# Altium project prj_prj0.PrjPcb
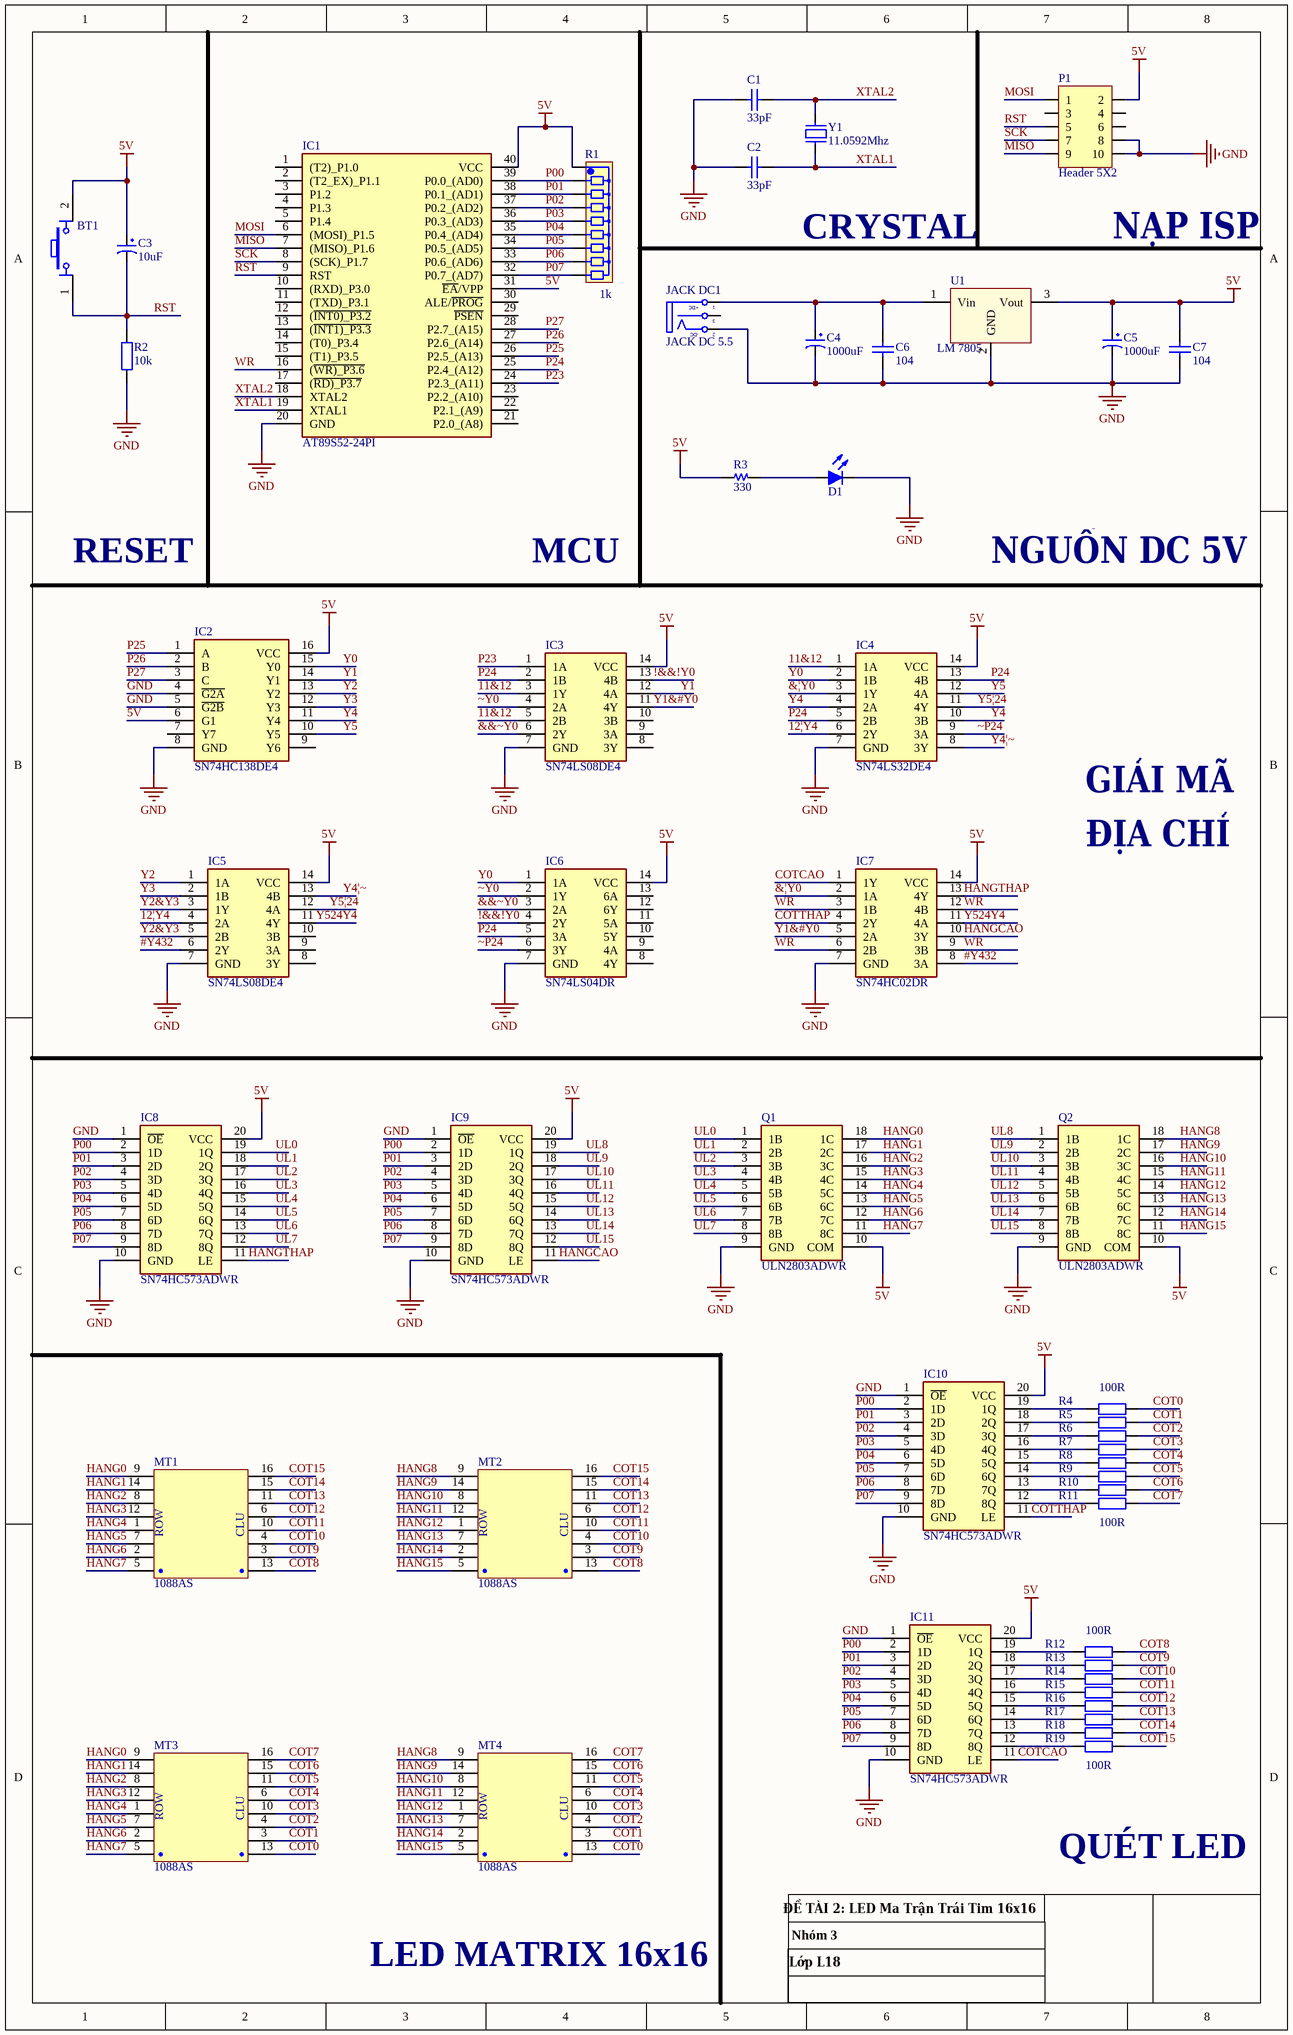
[diagram p0: sch_project0.SchDoc]
1 sheet, 49 parts. Net scope: global (net labels, ports and power ports of the same name join across sheets).
Board file: pcb_project0.PcbDoc

## Sheet sch_project0.SchDoc
size B portrait; SheetNumber: 1; SheetTotal: 1

### Parts
BT1  Nut Nhan 4 Chan Cam 6x6  [Nut Nhan 4 Chan Cam 6x6]  (value not drawn)
C1  33pF  [tu gom]
C2  33pF  [tu gom]
C3  10uF  [tu hoa 4mm]
C4  1000uF  [tu hoa 8mm]
C5  1000uF  [tu hoa 8mm]
C6  104  [tu gom]
C7  104  [tu gom]
D1  Led  [LED 5MM - RED]  (value not drawn)
IC1  AT89S52-24PI  [DIP1556W56P254L5232H483Q40N]
IC2  SN74HC138DE4  [SOIC127P600X175-16N]
IC3  SN74LS08DE4  [SOIC127P600X175-14N]
IC4  SN74LS32DE4  [SOIC127P600X175-14N]
IC5  SN74LS08DE4  [SOIC127P600X175-14N]
IC6  SN74LS04DR  [SOIC127P600X175-14N]
IC7  SN74HC02DR  [SOIC127P600X175-14N]
IC8  SN74HC573ADWR  [SOIC127P1030X265-20N]
IC9  SN74HC573ADWR  [SOIC127P1030X265-20N]
IC10  SN74HC573ADWR  [SOIC127P1030X265-20N]
IC11  SN74HC573ADWR  [SOIC127P1030X265-20N]
JACK_DC1  JACK DC 5.5  [JACK DC 5.5]
MT1  1088AS  [Matrix]
MT2  1088AS  [Matrix]
MT3  1088AS  [Matrix]
MT4  1088AS  [Matrix]
P1  Header 5X2  [HDR/Header/10/DL/BOX]
Q1  ULN2803ADWR  [SOIC127P1030X265-18N]
Q2  ULN2803ADWR  [SOIC127P1030X265-18N]
R1  1k  [tro bang a9]
R2  10k  [tro vach 1/4w]
R3  330  [R 1/4W/300]
R4  100R  [tro smd 0603]
R5  100R  [tro smd 0603]  (value not drawn)
R6  100R  [tro smd 0603]  (value not drawn)
R7  100R  [tro smd 0603]  (value not drawn)
R8  100R  [tro smd 0603]  (value not drawn)
R9  100R  [tro smd 0603]  (value not drawn)
R10  100R  [tro smd 0603]  (value not drawn)
R11  100R  [tro smd 0603]
R12  100R  [tro smd 0603]
R13  100R  [tro smd 0603]  (value not drawn)
R14  100R  [tro smd 0603]  (value not drawn)
R15  100R  [tro smd 0603]  (value not drawn)
R16  100R  [tro smd 0603]  (value not drawn)
R17  100R  [tro smd 0603]  (value not drawn)
R18  100R  [tro smd 0603]  (value not drawn)
R19  100R  [tro smd 0603]
U1  LM 7805  [TO-220]
Y1  11.0592Mhz  [Thach Anh 2 chan cam]

### Nets
5V: BT1.2 C3.1 C5.1 C7.1 IC1.31(~{EA}/VPP) IC1.40(VCC) IC2.6(G1) IC2.16(VCC) IC3.14(VCC) IC4.14(VCC) IC5.14(VCC) IC6.14(VCC) IC7.14(VCC) IC8.20(VCC) IC9.20(VCC) IC10.20(VCC) IC11.20(VCC) P1.2 Q1.10(COM) Q2.10(COM) R1.1 R3.1 U1.3(Vout)
GND: C1.2 C2.2 C4.2 C5.2 C6.2 C7.2 D1.2(K) IC1.20(GND) IC2.4(~{G2A}) IC2.5(~{G2B}) IC2.8(GND) IC3.7(GND) IC4.7(GND) IC5.7(GND) IC6.7(GND) IC7.7(GND) IC8.1(~{OE}) IC8.10(GND) IC9.1(~{OE}) IC9.10(GND) IC10.1(~{OE}) IC10.10(GND) IC11.1(~{OE}) IC11.10(GND) JACK_DC1.2(TN) P1.8 P1.10 Q1.9(GND) Q2.9(GND) R2.1 U1.2(GND)
11&12: IC3.3(1Y) IC3.5(2B) IC4.1(1A)
12|Y4: IC4.6(2Y) IC5.4(2A)
!&&!Y0: IC3.13(4B) IC6.4(2Y)
#Y432: IC5.6(2Y) IC7.8(3A)
&&~Y0: IC3.6(2Y) IC6.3(2A)
&|Y0: IC4.3(1Y) IC7.2(1A)
COT0: MT3.13(C1) MT4.13(C1) R4.2
COT1: MT3.3(C2) MT4.3(C2) R5.2
COT2: MT3.4(C3) MT4.4(C3) R6.2
COT3: MT3.10(C4) MT4.10(C4) R7.2
COT4: MT3.6(C5) MT4.6(C5) R8.2
COT5: MT3.11(C6) MT4.11(C6) R9.2
COT6: MT3.15(C7) MT4.15(C7) R10.2
COT7: MT3.16(C8) MT4.16(C8) R11.2
COT8: MT1.13(C1) MT2.13(C1) R12.2
COT9: MT1.3(C2) MT2.3(C2) R13.2
COT10: MT1.4(C3) MT2.4(C3) R14.2
COT11: MT1.10(C4) MT2.10(C4) R15.2
COT12: MT1.6(C5) MT2.6(C5) R16.2
COT13: MT1.11(C6) MT2.11(C6) R17.2
COT14: MT1.15(C7) MT2.15(C7) R18.2
COT15: MT1.16(C8) MT2.16(C8) R19.2
COTCAO: IC7.1(1Y) IC11.11(LE)
COTTHAP: IC7.4(2Y) IC10.11(LE)
HANG0: MT1.9(H8) MT3.9(H8) Q1.18(1C)
HANG1: MT1.14(H7) MT3.14(H7) Q1.17(2C)
HANG2: MT1.8(H6) MT3.8(H6) Q1.16(3C)
HANG3: MT1.12(H5) MT3.12(H5) Q1.15(4C)
HANG4: MT1.1(H4) MT3.1(H4) Q1.14(5C)
HANG5: MT1.7(H3) MT3.7(H3) Q1.13(6C)
HANG6: MT1.2(H2) MT3.2(H2) Q1.12(7C)
HANG7: MT1.5(H1) MT3.5(H1) Q1.11(8C)
HANG8: MT2.9(H8) MT4.9(H8) Q2.18(1C)
HANG9: MT2.14(H7) MT4.14(H7) Q2.17(2C)
HANG10: MT2.8(H6) MT4.8(H6) Q2.16(3C)
HANG11: MT2.12(H5) MT4.12(H5) Q2.15(4C)
HANG12: MT2.1(H4) MT4.1(H4) Q2.14(5C)
HANG13: MT2.7(H3) MT4.7(H3) Q2.13(6C)
HANG14: MT2.2(H2) MT4.2(H2) Q2.12(7C)
HANG15: MT2.5(H1) MT4.5(H1) Q2.11(8C)
HANGCAO: IC7.10(3Y) IC9.11(LE)
HANGTHAP: IC7.13(4Y) IC8.11(LE)
MISO: IC1.7((MISO)_P1.6) P1.9
MOSI: IC1.6((MOSI)_P1.5) P1.1
P00: IC1.39(P0.0_(AD0)) IC8.2(1D) IC9.2(1D) IC10.2(1D) IC11.2(1D) R1.2
P01: IC1.38(P0.1_(AD1)) IC8.3(2D) IC9.3(2D) IC10.3(2D) IC11.3(2D) R1.3
P02: IC1.37(P0.2_(AD2)) IC8.4(3D) IC9.4(3D) IC10.4(3D) IC11.4(3D) R1.4
P03: IC1.36(P0.3_(AD3)) IC8.5(4D) IC9.5(4D) IC10.5(4D) IC11.5(4D) R1.5
P04: IC1.35(P0.4_(AD4)) IC8.6(5D) IC9.6(5D) IC10.6(5D) IC11.6(5D) R1.6
P05: IC1.34(P0.5_(AD5)) IC8.7(6D) IC9.7(6D) IC10.7(6D) IC11.7(6D) R1.7
P06: IC1.33(P0.6_(AD6)) IC8.8(7D) IC9.8(7D) IC10.8(7D) IC11.8(7D) R1.8
P07: IC1.32(P0.7_(AD7)) IC8.9(8D) IC9.9(8D) IC10.9(8D) IC11.9(8D) R1.9
P23: IC1.24(P2.3_(A11)) IC3.1(1A)
P24: IC1.25(P2.4_(A12)) IC3.2(1B) IC4.5(2B) IC4.13(4B) IC6.5(3A)
P25: IC1.26(P2.5_(A13)) IC2.1(A)
P26: IC1.27(P2.6_(A14)) IC2.2(B)
P27: IC1.28(P2.7_(A15)) IC2.3(C)
RST: BT1.1 C3.2 IC1.9(RST) P1.5 R2.2
SCK: IC1.8((SCK)_P1.7) P1.7
UL0: IC8.19(1Q) Q1.1(1B)
UL1: IC8.18(2Q) Q1.2(2B)
UL2: IC8.17(3Q) Q1.3(3B)
UL3: IC8.16(4Q) Q1.4(4B)
UL4: IC8.15(5Q) Q1.5(5B)
UL5: IC8.14(6Q) Q1.6(6B)
UL6: IC8.13(7Q) Q1.7(7B)
UL7: IC8.12(8Q) Q1.8(8B)
UL8: IC9.19(1Q) Q2.1(1B)
UL9: IC9.18(2Q) Q2.2(2B)
UL10: IC9.17(3Q) Q2.3(3B)
UL11: IC9.16(4Q) Q2.4(4B)
UL12: IC9.15(5Q) Q2.5(5B)
UL13: IC9.14(6Q) Q2.6(6B)
UL14: IC9.13(7Q) Q2.7(7B)
UL15: IC9.12(8Q) Q2.8(8B)
WR: IC1.16((~{WR)_P3.6}) IC7.3(1B) IC7.6(2B) IC7.9(3B) IC7.12(4B)
XTAL1: C2.1 IC1.19(XTAL1) Y1.1
XTAL2: C1.1 IC1.18(XTAL2) Y1.2
Y0: IC2.15(Y0) IC4.2(1B) IC6.1(1A)
Y1: IC2.14(Y1) IC3.12(4A)
Y1&#Y0: IC3.11(4Y) IC7.5(2A)
Y2: IC2.13(Y2) IC5.1(1A)
Y2&Y3: IC5.3(1Y) IC5.5(2B)
Y3: IC2.12(Y3) IC5.2(1B)
Y4: IC2.11(Y4) IC4.4(2A) IC4.10(3B)
Y4|~: IC4.8(3Y) IC5.13(4B)
Y5: IC2.10(Y5) IC4.12(4A)
Y5|24: IC4.11(4Y) IC5.12(4A)
Y524Y4: IC5.11(4Y) IC7.11(4A)
~P24: IC4.9(3A) IC6.6(3Y)
~Y0: IC3.4(2A) IC6.2(1Y)
NetC4_1: C4.1 C6.1 JACK_DC1.1(T) U1.1(Vin)
NetD1_1: D1.1(A) R3.2
NetIC10_12: IC10.12(8Q) R11.1
NetIC10_13: IC10.13(7Q) R10.1
NetIC10_14: IC10.14(6Q) R9.1
NetIC10_15: IC10.15(5Q) R8.1
NetIC10_16: IC10.16(4Q) R7.1
NetIC10_17: IC10.17(3Q) R6.1
NetIC10_18: IC10.18(2Q) R5.1
NetIC10_19: IC10.19(1Q) R4.1
NetIC11_12: IC11.12(8Q) R19.1
NetIC11_13: IC11.13(7Q) R18.1
NetIC11_14: IC11.14(6Q) R17.1
NetIC11_15: IC11.15(5Q) R16.1
NetIC11_16: IC11.16(4Q) R15.1
NetIC11_17: IC11.17(3Q) R14.1
NetIC11_18: IC11.18(2Q) R13.1
NetIC11_19: IC11.19(1Q) R12.1

Not connected (* = marked no-connect by the designer): IC1 1((T2)_P1.0) 2((T2_EX)_P1.1) 3(P1.2) 4(P1.3) 5(P1.4) 10((RXD)_P3.0) 11((TXD)_P3.1) 12((~{INT0)_P3.2}) 13((~{INT1)_P3.3}) 14((T0)_P3.4) 15((T1)_P3.5) 17((~{RD)_P3.7}) 21(P2.0_(A8)) 22(P2.1_(A9)) 23(P2.2_(A10)) 29(~{PSEN}) 30(ALE/~{PROG}); IC2 7(Y7) 9(Y6); IC3 8(3Y) 9(3A) 10(3B); IC5 8(3Y) 9(3A) 10(3B); IC6 8(4Y) 9(4A) 10(5Y) 11(5A) 12(6Y) 13(6A); JACK_DC1 3(S); P1 3 4 6

### Notes on the sheet
- CRYSTAL
- NẠP ISP
- RESET
- MCU
- NGUỒN DC 5V
- GIẢI MÃ
- ĐỊA CHỈ
- ĐỀ TÀI 2: LED Ma Trận Trái Tim 16x16
- QUÉT LED
- LED MATRIX 16x16
- Nhóm 3
- Lớp L18
- (in symbol JACK DC 5.5) +DC; -DC
- (in symbol LED 8x8S) ROW; CLU

### Library data of the parts
BT1 = Nut Nhan 4 Chan Cam 6x6: Nut Nhan 4 Chan 6x6mm; Ten: Nút Nhấn 4 Chân 6x6x5MM DIP; Ma_Hang: MH004584
C1 C2 C6 C7 = Tu gom 104 50V: Cắm; So_Chan: 2; Ten_Linh_Kien: Tụ gốm 104 100nF 50V; Don_Vi: Con; Ma_Hang: MH004761; Chung_Loai: Cắm; Kieu_Chan: *
C3 = Tu Hoa 10uF 16V 4x7: Cắm; So_Chan: 2; Don_Vi: Con; Ten_Linh_Kien: Tụ Hóa 10uF 16V; Ma_Hang: MH006855; Chung_Loai: Cắm; Kieu_Chan: *
C4 C5 = Tu Hoa 1000uF 16V 8x20: Cắm; Don_Vi: Con; So_Chan: 2; Ten_Linh_Kien: Tụ Hóa 1000uF 16V 8x20MM; Ma_Hang: MH008300; Chung_Loai: Cắm; Kieu_Chan: *
D1 = Led: Typical LED
IC1 = AT89S52-24PI: Integrated Circuit; Manufacturer_Name: Microchip; Datasheet Link: http://www.microchip.com/mymicrochip/filehandler.aspx?ddocname=en590628; Height: 4.826mm; Manufacturer_Part_Number: AT89S52-24PI
IC2 = SN74HC138DE4: Integrated Circuit; Manufacturer_Name: Texas Instruments; Datasheet Link: https://www.ti.com/lit/ds/symlink/sn74hc138.pdf?HQS=TI-null-null-mousermode-df-pf-null-wwe&ts=1600076106087&ref_url=https%253A%252F%252Fwww.mouser.sg%252F; Height: 1.75mm; Manufacturer_Part_Number: SN74HC138DE4; Mouser Part Number: 595-SN74HC138DE4; Mouser Price/Stock: https://www.mouser.co.uk/ProductDetail/Texas-Instruments/SN74HC138DE4?qs=AgY10sKTvDISmT%2FT80QgQA%3D%3D; Arrow Part Number: SN74HC138DE4; Arrow Price/Stock: https://www.arrow.com/en/products/sn74hc138de4/texas-instruments
IC3 IC5 = SN74LS08DE4: Integrated Circuit; Manufacturer_Name: Texas Instruments; Datasheet Link: http://www.ti.com/general/docs/suppproductinfo.tsp?distId=26&gotoUrl=http%3A%2F%2Fwww.ti.com%2Flit%2Fgpn%2FSN74LS08; Height: 1.75mm; Manufacturer_Part_Number: SN74LS08DE4; Mouser Part Number: 595-SN74LS08DE4; Mouser Price/Stock: https://www.mouser.com/Search/Refine.aspx?Keyword=595-SN74LS08DE4; Arrow Part Number: SN74LS08DE4; Arrow Price/Stock: https://www.arrow.com/en/products/sn74ls08de4/texas-instruments
IC4 = SN74LS32DE4: Integrated Circuit; Manufacturer_Name: Texas Instruments; Datasheet Link: https://www.arrow.com/en/products/sn74ls32de4/texas-instruments; Height: 1.75mm; Manufacturer_Part_Number: SN74LS32DE4; Mouser Part Number: 595-SN74LS32DE4; Mouser Price/Stock: https://www.mouser.co.uk/ProductDetail/Texas-Instruments/SN74LS32DE4?qs=SL3LIuy2dWyjvHQzVXNE%252BQ%3D%3D; Arrow Part Number: SN74LS32DE4; Arrow Price/Stock: https://www.arrow.com/en/products/sn74ls32de4/texas-instruments
IC6 = SN74LS04DR: Integrated Circuit; Manufacturer_Name: Texas Instruments; Datasheet Link: http://www.ti.com/lit/ds/symlink/sn74ls04.pdf; Height: 1.75mm; Manufacturer_Part_Number: SN74LS04DR; Mouser Part Number: 595-SN74LS04DR; Mouser Price/Stock: https://www.mouser.co.uk/ProductDetail/Texas-Instruments/SN74LS04DR?qs=SL3LIuy2dWzOhepjTMFpMg%3D%3D; Arrow Part Number: SN74LS04DR; Arrow Price/Stock: https://www.arrow.com/en/products/sn74ls04dr/texas-instruments?region=nac
IC7 = SN74HC02DR: Integrated Circuit; Manufacturer_Name: Texas Instruments; Datasheet Link: https://datasheet.datasheetarchive.com/originals/distributors/Datasheets-302/22846.pdf; Height: 1.75mm; Manufacturer_Part_Number: SN74HC02DR; Mouser Part Number: 595-SN74HC02DR; Mouser Price/Stock: https://www.mouser.co.uk/ProductDetail/Texas-Instruments/SN74HC02DR?qs=8Pd2FuFSoMFT9aaH6e%2FOvg%3D%3D; Arrow Part Number: SN74HC02DR; Arrow Price/Stock: https://www.arrow.com/en/products/sn74hc02dr/texas-instruments
IC8-IC11 = SN74HC573ADWR: Integrated Circuit; Manufacturer_Name: Texas Instruments; Datasheet Link: http://www.ti.com/general/docs/suppproductinfo.tsp?distId=10&gotoUrl=http%3A%2F%2Fwww.ti.com%2Flit%2Fgpn%2Fsn74hc573a; Height: 2.65mm; Manufacturer_Part_Number: SN74HC573ADWR; Mouser Part Number: 595-SN74HC573ADWR; Mouser Price/Stock: https://www.mouser.co.uk/ProductDetail/Texas-Instruments/SN74HC573ADWR?qs=UGVLDq%2F29ujbqVJVoJsRcQ%3D%3D; Arrow Part Number: SN74HC573ADWR; Arrow Price/Stock: https://www.arrow.com/en/products/sn74hc573adwr/texas-instruments
JACK_DC1 = JACK DC 5.5: Value: Jac DC
MT1-MT4 = LED 8x8S: Matrix 8x8,  Single colour; Value: Matrix 8x8S
P1 = Header 5X2: Header, 5-Pin, Dual row
Q1 Q2 = ULN2803ADWR: Transistor; Manufacturer_Name: Texas Instruments; Datasheet Link: http://www.ti.com/lit/gpn/uln2803a; Height: 2.65mm; Manufacturer_Part_Number: ULN2803ADWR; Mouser Part Number: 595-ULN2803ADWR; Mouser Price/Stock: https://www.mouser.co.uk/ProductDetail/Texas-Instruments/ULN2803ADWR?qs=zqbRmZ%252BfZD8M77SqrzUfYg%3D%3D; Arrow Part Number: ULN2803ADWR; Arrow Price/Stock: https://www.arrow.com/en/products/uln2803adwr/texas-instruments?region=nac
R1 = Tro Bang A9 1k: Cắm; Don_Vi: Con; So_Chan: 9; Ten_Linh_Kien: Trở Băng A09-102 1k 1/8w 5%; Ma_Hang: MH001435; Chung_Loai: Cắm; Kieu_Chan: *
R2 = Tro Vach 1/4W 5% 10k: Căm; Chung_Loai: Cắm; Don_Vi: Con; So_Chan: 2; Ten_Linh_Kien: Trở Vạch 1/4w 5% 10K; Ma_Hang: MH007354; Kieu_Chan: *
R3 = Resistor
R4-R19 = Tro 0603 5% 100R: Dán; Don_Vi: Con; So_Chan: 2; Ten_Linh_Kien: Trở 0603 5% 100R; Ma_Hang: MH006315; Chung_Loai: Dán; Kieu_Chan: *
U1 = 78xx: LDO Fixed Voltage regulator
Y1 = Thach Anh 2 chan Cam: Crystal For all Crystal 2pin.; Value: 4Mhz